# EAGLE design L3D_Main Board_v2 (EAGLE 7.7.0)
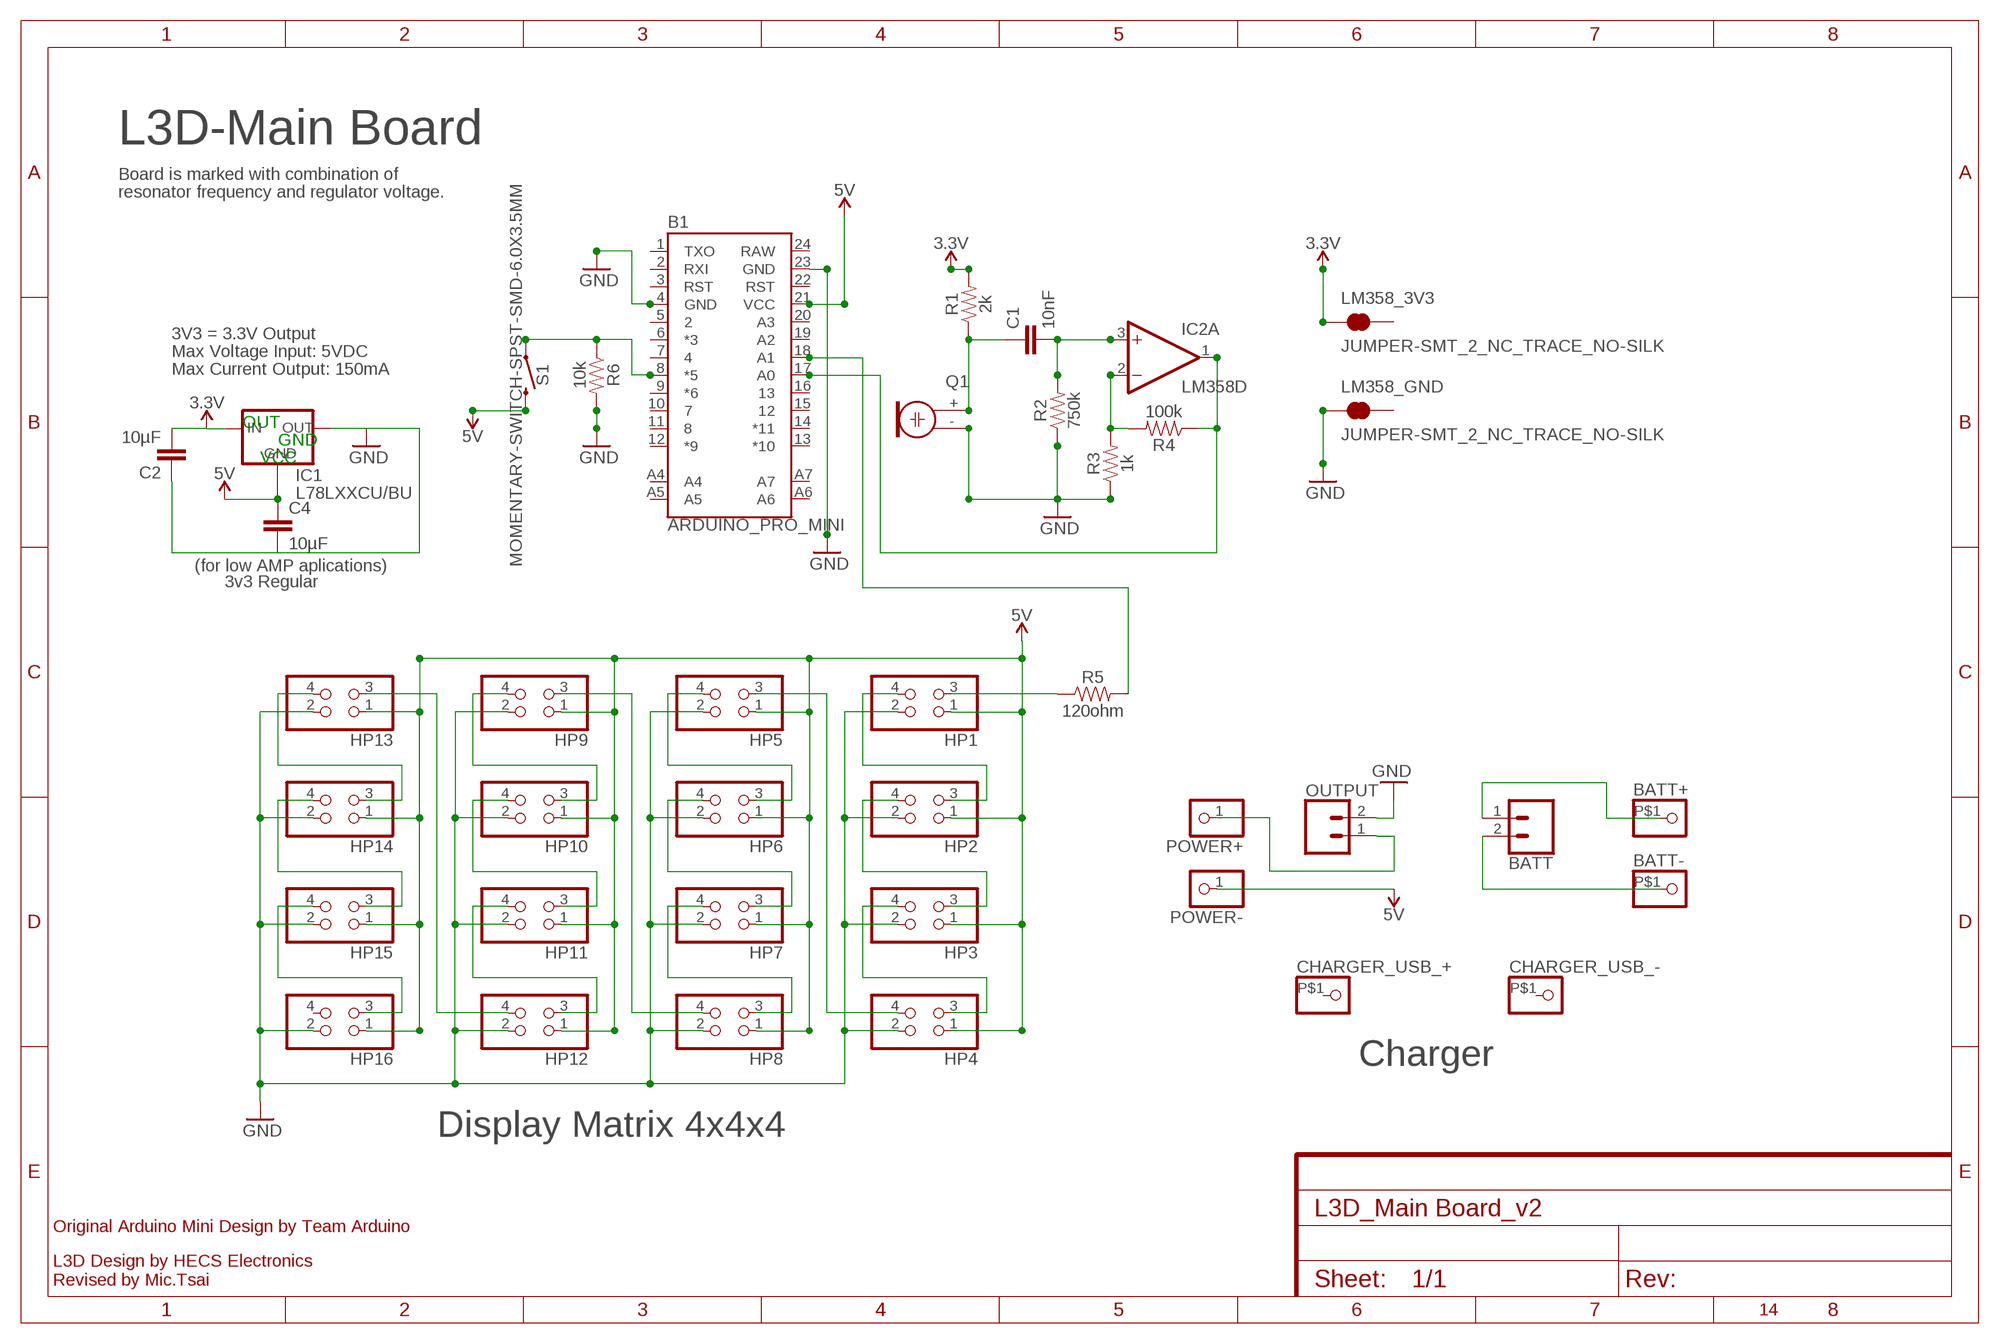
[diagram p0: schematic, sheet 1]

## Parts
B1  ARDUINO_PRO_MINI  [ARDUINO_PRO_MINI]
BATT  CONN_02  [1X02]
BATT+  PINHD-1X1-BIGPOGO  [1X1-BIGPOGO]
BATT-  PINHD-1X1-BIGPOGO  [1X1-BIGPOGO]
C1  10nF  0.33UF/330NF-0805-50V-10%  [0805]
C2  10µF  0.33UF/330NF-0805-50V-10%  [0805]
C4  10µF  0.33UF/330NF-0805-50V-10%  [0805]
CHARGER_USB_+  PINHD-1X1-BIGPOGO  [1X1-BIGPOGO]
CHARGER_USB_-  PINHD-1X1-BIGPOGO  [1X1-BIGPOGO]
HP1  PINHD-2X2_2.00  [2X02M]
HP2  PINHD-2X2_2.00  [2X02M]
HP3  PINHD-2X2_2.00  [2X02M]
HP4  PINHD-2X2_2.00  [2X02M]
HP5  PINHD-2X2_2.00  [2X02M]
HP6  PINHD-2X2_2.00  [2X02M]
HP7  PINHD-2X2_2.00  [2X02M]
HP8  PINHD-2X2_2.00  [2X02M]
HP9  PINHD-2X2_2.00  [2X02M]
HP10  PINHD-2X2_2.00  [2X02M]
HP11  PINHD-2X2_2.00  [2X02M]
HP12  PINHD-2X2_2.00  [2X02M]
HP13  PINHD-2X2_2.00  [2X02M]
HP14  PINHD-2X2_2.00  [2X02M]
HP15  PINHD-2X2_2.00  [2X02M]
HP16  PINHD-2X2_2.00  [2X02M]
IC1  L78LXXCU/BU  [SOT89]
IC2  LM358D  [SO08]
LM358_3V3  JUMPER-SMT_2_NC_TRACE_NO-SILK  [SMT-JUMPER_2_NC_TRACE_NO-SILK]
LM358_GND  JUMPER-SMT_2_NC_TRACE_NO-SILK  [SMT-JUMPER_2_NC_TRACE_NO-SILK]
OUTPUT  CONN_02  [1X02]
POWER+  PINHD-1X1  [1X01]
POWER-  PINHD-1X1  [1X01]
Q1  ELECTRET  [9.7ELECTRET]
R1  2k  820KOHM-0603-1/10W-1%  [0603]
R2  750k  820KOHM-0603-1/10W-1%  [0603]
R3  1k  820KOHM-0603-1/10W-1%  [0603]
R4  100k  820KOHM-0603-1/10W-1%  [0603]
R5  120ohm  0.1OHM-1210-1/2W-1%  [1210]
R6  10k  820KOHM-0603-1/10W-1%  [0603]
S1  MOMENTARY-SWITCH-SPST-SMD-6.0X3.5MM  [TACTILE_SWITCH_SMD_6.0X3.5MM]

## Nets
3.3V: C2.2 IC1.3(IN) LM358_3V3.1 R1.2
5V: B1.21(VCC) C4.1 HP1.1 HP2.1 HP3.1 HP4.1 HP5.1 HP6.1 HP7.1 HP8.1 HP9.1 HP10.1 HP11.1 HP12.1 HP13.1 HP14.1 HP15.1 HP16.1 IC1.4(GND1) POWER-.1 S1.2
GND [vcc]: B1.4(GND) B1.23(GND) C2.1 C4.2 HP1.2 HP2.2 HP3.2 HP4.2 HP5.2 HP6.2 HP7.2 HP8.2 HP9.2 HP10.2 HP11.2 HP12.2 HP13.2 HP14.2 HP15.2 HP16.2 IC1.1(OUT) LM358_GND.1 OUTPUT.2 Q1.- R2.1 R3.1 R6.2
N$1: C1.2 IC2.3(A:+IN) R2.2
N$2: C1.1 Q1.+ R1.1
N$3: IC2.2(A:-IN) R3.2 R4.2
N$4: HP1.4 HP2.3
N$5: HP2.4 HP3.3
N$6: HP3.4 HP4.3
N$7: HP4.4 HP5.3
N$8: HP5.4 HP6.3
N$9: HP6.4 HP7.3
N$10: HP7.4 HP8.3
N$11: HP8.4 HP9.3
N$12: HP9.4 HP10.3
N$13: HP10.4 HP11.3
N$14: HP11.4 HP12.3
N$15: HP12.4 HP13.3
N$16: HP13.4 HP14.3
N$17: HP14.4 HP15.3
N$18: HP15.4 HP16.3
N$19: B1.17(A0) IC2.1(A:OUT) R4.1
N$20: B1.8(*5) R6.1 S1.1
N$21: OUTPUT.1 POWER+.1
N$22: B1.18(A1) R5.2
N$23: HP1.3 R5.1
N$24: BATT+.P$1 BATT.1
N$25: BATT-.P$1 BATT.2
Unconnected: B1.1(TXO) B1.2(RXI) B1.3(RST) B1.5 B1.6(*3) B1.7 B1.9(*6) B1.10 B1.11 B1.12(*9) B1.13(*10) B1.14(*11) B1.15 B1.16 B1.19(A2) B1.20(A3) B1.22(RST) B1.A4 B1.A5 B1.A6 B1.A7 CHARGER_USB_+.P$1 CHARGER_USB_-.P$1 HP16.4 IC1.2(GND) IC2.5(B:+IN) IC2.6(B:-IN) IC2.7(B:OUT) LM358_3V3.2 LM358_GND.2

## Notes on the sheet
- L3D-Main Board
- Board is marked with combination of
- resonator frequency and regulator voltage.
- 3V3 = 3.3V Output
- Max Voltage Input: 5VDC
- Max Current Output: 150mA
- OUT
- GND
- VCC
- (for low AMP aplications)
- 3v3 Regular
- Charger
- Display Matrix 4x4x4
- Original Arduino Mini Design by Team Arduino
- L3D Design by HECS Electronics
  Revised by Mic.Tsai
- 14

## Power pins joined to a net without a drawn wire
RAW: B1.24(RAW)
V+: IC2.8(P:V+)
V-: IC2.4(P:V-)

## Library data of the parts
B1 = SparkFun-Boards:ARDUINO_PRO_MINI: SparkFun Pro Mini Pro Mini compatible footprint. Dimensions: 0.7 x 1.3" PCB Thickness: 0.8mm SparkFun Products: 3.3V/8MHz <https://www.sparkfun.com/products/11114> 5V/16MHz <https://www.sparkfun.com/products/11113>
BATT OUTPUT = SparkFun-Connectors:CONN_02: Multi connection point. Often used as Generic Header-pin footprint for 0.1 inch spaced/style header connections On any of the 0.1 inch spaced packages, you can populate with these: Break Away Headers - Straight <https://www.sparkfun.com/products/116> (PRT-00116) Break Away Male Headers - Right Angle <https://www.sparkfun.com/products/553> (PRT-00553) Female Headers <https://www.sparkfun.com/products/115> (PRT-00115) Break Away Headers - Machine Pin <https://www.sparkfun.com/products/117> (PRT-00117) Break Away Female Headers - Swiss Machine Pin <https://www.sparkfun.com/products/743> (PRT-00743) For SCREWTERMINALS and SPRING TERMINALS visit here: Screw Terimnals on SparkFun.com <https://www.sparkfun.com/search/results?term=Screw+Terminals> (5mm/3.5mm/2.54mm spacing) This device is also useful as a general connection point to wire up your design to another part of your project. Our various solder wires solder well into these plated through hole pads. Hook-Up Wire - Assortment (Stranded, 22 AWG) <https://www.sparkfun.com/products/11375> (PRT-11375) Hook-Up Wire - Assortment (Solid Core, 22 AWG) <https://www.sparkfun.com/products/11367> (PRT-11367) View the entire wire category on our website here <https://www.sparkfun.com/categories/141> Special notes: Molex polarized connector foot print use with: PRT-08233 with associated crimp pins and housings. 2.54_SCREWTERM for use with PRT-10571. 3.5mm Screw Terminal footprints for PRT-08084 5mm Screw Terminal footprints for use with PRT-08432
BATT+ BATT- CHARGER_USB_+ CHARGER_USB_- POWER+ POWER- = adafruit:PINHD-1X1: Pin header 1x1 for 0.1" spacing With round pins
C1 C2 C4 = SparkFun-Capacitors:0.33UF/330NF: 0.33µF/330nF ceramic capacitors A capacitor is a passive two-terminal electrical component used to store electrical energy temporarily in an electric field.; PROD_ID: CAP-08469; VALUE: 0.33µF
HP1-HP16 = pinhead-1:PINHD-2X2: PIN HEADER
IC1 = v-reg-2:L78LXXCU/BU: VOLTAGE REGULATOR
IC2 = linear:LM358: OP AMP also LM158; LM258; LM2904 Source: http://cache.national.com/ds/LM/LM158.pdf
LM358_3V3 LM358_GND = SparkFun-Jumpers:JUMPER-SMT_2_NC_TRACE: Normally closed trace jumper This jumper has a trace between two pads so it's normally closed (NC). Use a razor knife to open the connection. For best results follow the IPC guidelines for cutting traces: Cutout at least 0.063 mm (0.005 in). Remove all loose material to clean up the cut area. Seal the cut with an approved epoxy. Reapply solder to reclose the connection.
Q1 = adafruit:ELECTRET: Electret microphone Thru hole 2.54mm spacing with 9.7mm diameter
R1-R4 R6 = SparkFun-Resistors:820KOHM: 820kΩ resistor A resistor is a passive two-terminal electrical component that implements electrical resistance as a circuit element. Resistors act to reduce current flow, and, at the same time, act to lower voltage levels within circuits. - Wikipedia; PROD_ID: RES-13247; VALUE: 820k
R5 = SparkFun-Resistors:0.1OHM: 0.1Ω resistor A resistor is a passive two-terminal electrical component that implements electrical resistance as a circuit element. Resistors act to reduce current flow, and, at the same time, act to lower voltage levels within circuits. - Wikipedia; PROD_ID: RES-12374; VALUE: 0.1
S1 = SparkFun-Switches:MOMENTARY-SWITCH-SPST: Momentary Switch (Pushbutton) - SPST Normally-open (NO) SPST momentary switches (buttons, pushbuttons). Variants PTH-12MM - 12mm square, through-hole Momentary Pushbutton Switch - 12mm Square <https://www.sparkfun.com/products/9190> (COM-09190) PTH-6.0MM, PTH-6.0MM-KIT - 6.0mm square, through-hole Mini Pushbutton Switch <https://www.sparkfun.com/products/97> (COM-00097) KIT package intended for soldering kit's - only one side of pads' copper is exposed. PTH-RIGHT-ANGLE-KIT - Right-angle, through-hole Right Angle Tactile Button <https://www.sparkfun.com/products/10791> - Used on SparkFun BigTime Watch Kit <https://www.sparkfun.com/products/11734> SMD-12MM - 12mm square, surface-mount Tactile Button - SMD (12mm) <https://www.sparkfun.com/products/12993> (COM-12993) Used on SparkFun PicoBoard <https://www.sparkfun.com/products/11888> SMD-4.5MM - 4.5mm Square Trackball Switch Used on SparkFun Blackberry Trackballer Breakout <https://www.sparkfun.com/products/13169> SMD-4.6MMX2.8MM - 4.60mm x 2.80mm, surface mount Used on SparkFun SAMD21 Mini Breakout <https://www.sparkfun.com/products/13664> SMD-5.2MM, SMD-5.2-REDUNDANT - 5.2mm square, surface-mount Mini Pushbutton Switch - SMD <https://www.sparkfun.com/products/8720> (COM-08720) Used on Arduino Pro Mini <https://www.sparkfun.com/products/11114> REDUNDANT package connects both switch circuits together SMD-6.0X3.5MM - 6.0 x 3.5mm, surface mount Momentary Reset Switch SMD <https://www.sparkfun.com/products/8229> (COM-08229) SMD-6.2MM-TALL - 6.2mm square, surface mount Tactile Button - SMD (6mm) <https://www.sparkfun.com/products/12992> Used on SparkFun Digital Sandbox <https://www.sparkfun.com/products/12651> SMD-RIGHT-ANGLE - Right-angle, surface mount Used on SparkFun Block for Intel® Edison - Arduino <https://www.sparkfun.com/products/13036>; PROD_ID: SWCH-00815; SF_SKU: COM-08229

## Net classes
0 default: width 0.203 mm
1 vcc: width 0.254 mm

## Board
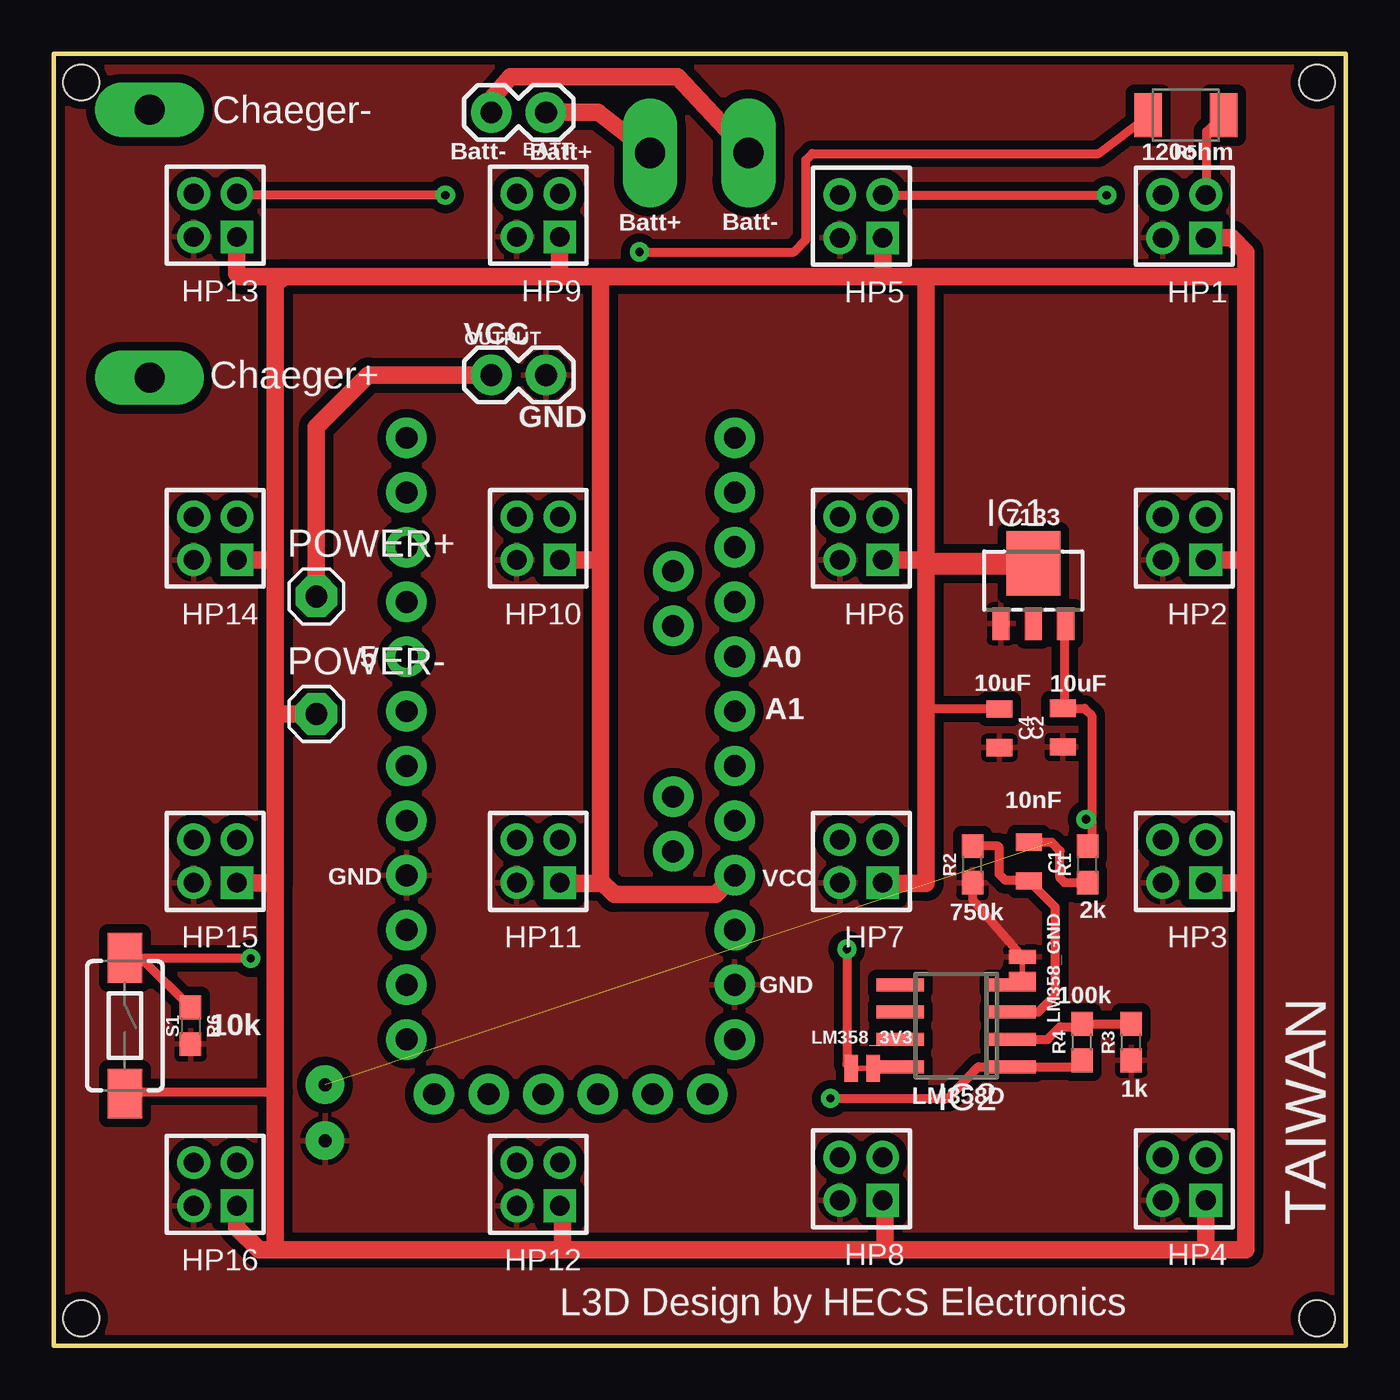
[diagram p1: board, top side]
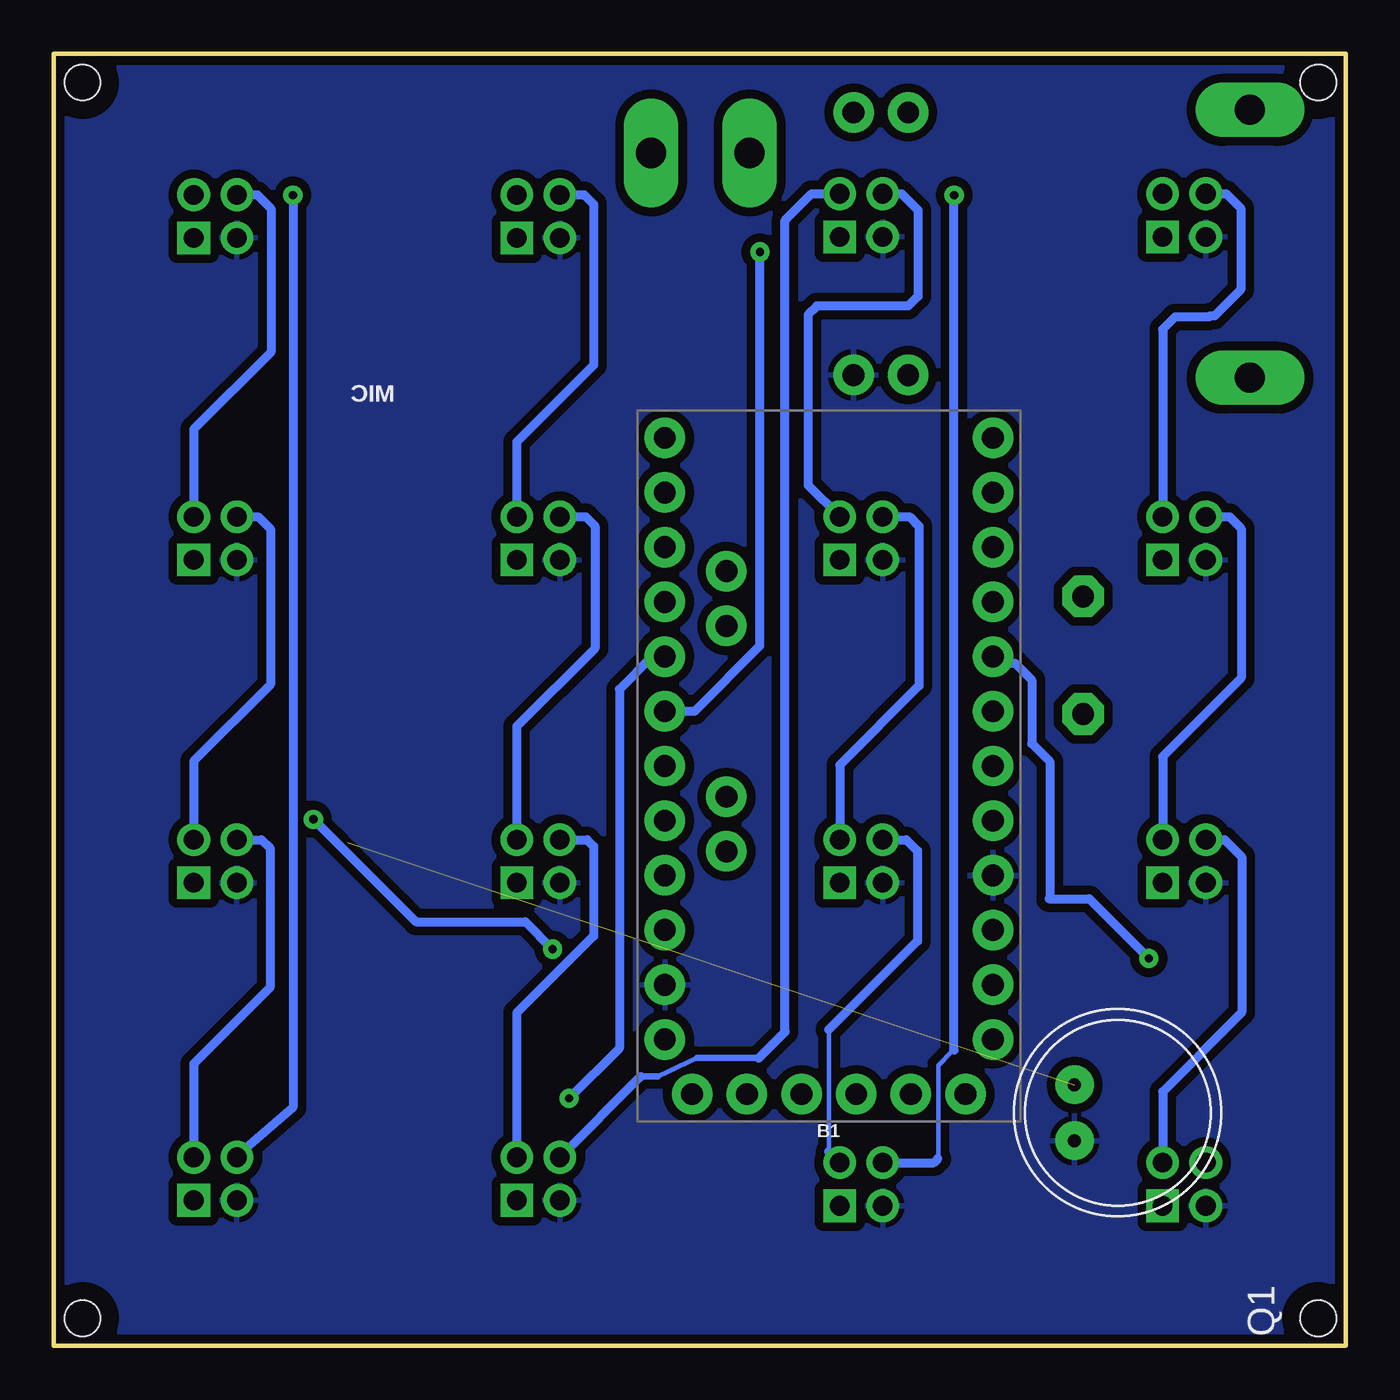
[diagram p2: board, bottom side, seen from below]

Size 60 x 60 mm. Coordinates in mm from the lower left corner, seen from the top.
Outline: 0,60 0,0 60,0 60,60 0,60
Copper layers (1*16): Top 0.035mm / dielectric 1.5mm / Bottom 0.035mm
Design rules "SparkFun-2-layer *": minimum track width 7mil, minimum drill 15mil, track to track 8mil, track to pad 8mil, pad to pad 8mil, via to via 8mil, smd to smd 8mil, copper to edge 8mil, drill to drill 8mil, minimum pad ring 12mil, minimum via ring 10mil, stop-mask expansion 4mil, vias tented up to drill 20mil, thermal gap 10mil
Holes 1.65 mm at 1.27,1.27 58.67,1.27 1.27,58.67 58.67,58.67
bRestrict: area 0.1,0.1 to 2.4,2.4; area 57.5,0.1 to 59.8,2.4; area 0.1,57.5 to 2.4,59.8; area 57.5,57.5 to 59.8,59.8

### Footprints (pad centres in the part's own frame; a part is rotated, then mirrored left to right if it is on the bottom)
ARDUINO_PRO_MINI = drill 1.016 pad 1.88: 1 -7.62,12.7; 2 -7.62,10.16; 3 -7.62,7.62; 4 -7.62,5.08; 5 -7.62,2.54; 6 -7.62,0; 7 -7.62,-2.54; 8 -7.62,-5.08; 9 -7.62,-7.62; 10 -7.62,-10.16; 11 -7.62,-12.7; 12 -7.62,-15.24; 13 7.62,-15.24; 14 7.62,-12.7; 15 7.62,-10.16; 16 7.62,-7.62; 17 7.62,-5.08; 18 7.62,-2.54; 19 7.62,0; 20 7.62,2.54; 21 7.62,5.08; 22 7.62,7.62; 23 7.62,10.16; 24 7.62,12.7; A4 4.763,1.429; A5 4.763,3.969; A6 4.763,-9.049; A7 4.763,-6.509; BLK -6.35,15.24; GND -3.81,15.24; GRN 6.35,15.24; RXI 1.27,15.24; TXO 3.81,15.24; VCC -1.27,15.24
1X02 = drill 1.016 pad 1.88: 1 0,0; 2 2.54,0
1X1-BIGPOGO = drill 1.4 pad 2.54 long: P$1 0,0
0805 = smd 0.8 x 1.2: 1 -0.9,0; 2 0.9,0
2X02M = drill 0.914 square: 1 -1,-1 | drill 0.914: 2 -1,1; 3 1,-1; 4 1,1
SOT89 = smd 0.8 x 1.5: 1 -1.5,-1.75; 2 0,-1.75; 3 1.5,-1.75 | smd 2.5 x 3: 4 0,1.05
SO08 = smd 0.6 x 2.2: 1 -1.905,-2.6; 2 -0.635,-2.6; 3 0.635,-2.6; 4 1.905,-2.6; 5 1.905,2.6; 6 0.635,2.6; 7 -0.635,2.6; 8 -1.905,2.6
SMT-JUMPER_2_NC_TRACE_NO-SILK = smd 0.635 x 1.27: 1 -0.508,0; 2 0.508,0
1X01 = drill 1.016 pad 1.93 octagon: 1 0,0
9.7ELECTRET = drill 0.6 pad 1.778: + 1.3,2; - -1.3,2
0603 = smd 1.1 x 1: 1 -0.85,0; 2 0.85,0
1210 = smd 1.27 x 2.06: 1 -1.755,0; 2 1.755,0
TACTILE_SWITCH_SMD_6.0X3.5MM = smd 2.3 x 1.6: 1 -3.15,0; 2 3.15,0

### Placement (x,y rotation side)
B1  24,26.92 180 bottom
BATT  22.86,57.28 180 top
BATT+  27.69,55.4 270 bottom
BATT-  32.26,55.4 270 bottom
C1  45.29,22.48 270 top
C2  46.86,28.7 90 top
C4  43.92,28.68 270 top
CHARGER_USB_+  4.45,44.96 0 top
CHARGER_USB_-  4.45,57.4 0 top
HP1  52.5,52.45 90 top
HP2  52.5,37.5 90 top
HP3  52.5,22.5 90 top
HP4  52.5,7.75 90 top
HP5  37.5,52.45 90 top
HP6  37.5,37.5 90 top
HP7  37.5,22.5 90 top
HP8  37.5,7.75 90 top
HP9  22.5,52.5 90 top
HP10  22.5,37.5 90 top
HP11  22.5,22.5 90 top
HP12  22.5,7.5 90 top
HP13  7.5,52.5 90 top
HP14  7.5,37.5 90 top
HP15  7.5,22.5 90 top
HP16  7.5,7.5 90 top
IC1  45.49,35.28 0 top
IC2  41.91,14.86 90 top
LM358_3V3  37.54,12.88 0 top
LM358_GND  44.98,17.55 270 top
OUTPUT  20.32,45.09 0 top
POWER+  12.19,34.8 0 top
POWER-  12.19,29.34 0 top
Q1  10.59,10.82 90 bottom
R1  48.01,22.35 90 top
R2  42.67,22.35 90 top
R3  50.04,14.1 90 top
R4  47.75,14.1 90 top
R5  52.58,57.15 180 top
R6  6.35,14.86 270 top
S1  3.3,14.86 270 top

### Tracks (layer width: path | path; a pad name or v marks a point on that pad's centre or on a via)
3.3V  (via drill 0.38)
  Top 0.203: 46.97,29.67 46.94,29.67 C2.2 | 46.97,33.53 IC1.3 | v47.94,24.45 48.21,24.45 48.26,24.45
  Top 0.406: 46.97,29.67 46.97,33.53 | C2.2 47.87,29.6 48.21,29.26 48.21,24.45 48.21,23.41 R1.2 | v36.83,18.41 36.83,13.08 LM358_3V3.1
  Bottom 0.406: v36.83,18.41 38.1,19.68 43.18,19.68 v47.94,24.45
5V
  Top 0.203: 3.35,11.79 S1.2 | 43.89,29.57 C4.1 | 44.3,36.47 44.4,36.37 45.41,36.37 IC1.4
  Top 0.406: 3.35,11.79 10.29,11.79 | 43.89,29.57 40.51,29.57 40.51,29.52
  Top 0.61: 55.4,41.81 55.37,41.78
  Top 0.813: HP16.1 8.5,5.47 9.53,4.45 23.62,4.45 | 23.62,4.45 38.61,4.45 | 38.61,4.45 53.47,4.45 | 53.47,4.45 55.37,4.45 55.37,21.59 | HP4.1 53.5,4.48 53.47,4.45 | HP12.1 23.62,6.38 23.62,4.45 | HP8.1 38.61,6.64 38.61,4.45 | 55.37,49.66 55.37,41.78 55.37,36.32 | 55.37,36.32 55.37,21.59 | HP1.1 54.72,51.45 55.37,50.8 55.37,49.66 | 55.37,49.66 40.51,49.66 | 23.5,49.66 10.67,49.66 | 10.67,49.66 8.64,49.66 8.5,49.79 HP13.1 | 10.67,49.66 10.29,49.28 10.29,36.32 | 10.29,36.32 10.29,29.08 | 10.29,29.08 10.29,21.46 | 10.29,4.57 10.29,11.79 10.29,21.46 | 10.29,21.46 10.25,21.5 HP15.1 | HP14.1 10.11,36.5 10.29,36.32 | POWER-.1 10.54,29.34 10.29,29.08 | HP5.1 38.5,49.77 38.61,49.66 | 38.61,49.66 25.4,49.66 | 25.4,49.66 25.4,36.32 | 25.4,36.32 25.4,21.59 | 25.4,21.59 25.4,21.46 23.54,21.46 HP11.1 | 25.4,49.66 23.5,49.66 | 23.5,49.66 HP9.1 | 38.61,49.66 40.51,49.66 | 40.51,49.66 40.51,36.45 | 40.51,36.45 40.51,29.52 40.51,21.46 38.54,21.46 HP7.1 | HP10.1 25.22,36.5 25.4,36.32 | HP6.1 40.46,36.5 40.51,36.45 | HP2.1 55.19,36.5 55.37,36.32 | HP3.1 55.28,21.5 55.37,21.59 | B1.21 30.73,20.95 26.04,20.95 25.4,21.59
  Top 1.016: 40.51,36.45 40.63,36.33 IC1.4
GND
  Top 0.406: R2.1 42.67,20.73 LM358_GND.1
  pour Top (isolate 0.406): 0.25,59.75 59.75,59.75 59.75,0.25 0.25,0.25
  pour Bottom (isolate 0.406): 0.25,59.75 59.75,59.75 59.75,0.25 0.25,0.25
N$1
  Top 0.406: R2.2 43.85,23.2 43.92,23.14 43.92,21.89 44.2,21.61 45.25,21.61 C1.2 46.51,20.36 46.51,16.28 45.72,15.49 IC2.3
N$2  (1 unrouted)
  Top 0.406: R1.1 46.95,21.5 46.74,21.72 46.74,22.99 46.34,23.38 C1.1
N$3
  Top 0.406: IC2.2 46.15,14.22 46.74,14.81 47.61,14.81 R4.2 R3.2
N$4
  Bottom 0.406: HP1.4 50.55,53.45 49.91,52.81 49.91,46.15 53.5,42.56 HP2.3
N$5
  Bottom 0.406: HP2.4 50.51,38.5 49.94,37.92 49.94,30.71 53.5,27.14 HP3.3
N$6
  Bottom 0.406: HP3.4 50.35,23.5 49.96,23.11 49.96,16.64 53.5,13.1 HP4.3
N$7  (via drill 0.38)
  Top 0.203: HP5.3
  Top 0.406: HP5.3 v48.9,53.44
  Bottom 0.406: v48.9,53.44 48.9,11.07 51.08,9.17 51.41,8.84 HP4.4
N$8
  Bottom 0.406: HP5.4 35.37,53.45 34.92,53.01 34.92,45.54 38.5,41.97 HP6.3
N$9
  Bottom 0.406: HP6.4 35.3,38.5 34.87,38.08 34.87,32.38 38.5,28.76 HP7.3
N$10
  Bottom 0.406: HP7.4 35.23,23.5 34.92,23.19 34.92,19.02 38.5,15.45 HP8.3
N$11
  Bottom 0.203: 31.93,12.5 30.12,13.36
  Bottom 0.305: 32.75,12.5 31.93,12.5 | 30.12,13.36 27.25,13.36
  Bottom 0.406: HP8.4 32.75,12.5 | 27.25,13.36 26.04,14.58 26.04,52.27 24.81,53.5 HP9.3
N$12
  Bottom 0.406: HP9.4 20.63,53.5 19.86,52.73 19.86,48.74 20.32,48.28 24.56,48.28 24.97,47.88 24.97,39.97 HP10.3
N$13
  Bottom 0.406: HP10.4 20.26,38.5 19.81,38.05 19.81,30.66 23.5,26.97 HP11.3
N$14
  Bottom 0.203: 24,14.68 24,9
  Bottom 0.406: HP11.4 20.4,23.5 19.89,22.99 19.89,18.8 24,14.68 | 24,9 HP12.3
N$15  (via drill 0.38)
  Top 0.203: 8.53,53.44 HP13.3
  Top 0.406: v18.19,53.44 8.53,53.44
  Bottom 0.203: 18.95,8.69 18.92,8.71 18.92,13.03 18.29,13.66 18.19,13.72
  Bottom 0.406: HP12.4 19.14,8.5 18.95,8.69 | 18.19,13.72 v18.19,53.44
N$16
  Bottom 0.406: HP13.4 5.54,53.5 4.88,52.83 4.88,49.05 6.1,47.83 6.3,47.83 6.35,47.78 7.92,47.78 8.5,47.2 HP14.3
N$17
  Bottom 0.406: HP14.4 5.4,38.5 4.85,37.95 4.85,31.01 8.5,27.36 HP15.3
N$18
  Bottom 0.406: HP15.4 5.62,23.5 4.83,22.71 4.83,15.47 8.5,11.79 HP16.3
N$19  (via drill 0.38)
  Top 0.203: 44.6,12.95 IC2.1
  Top 0.406: IC2.1 42.95,12.95 41.55,11.48 v36.07,11.48 | 44.6,12.95 47.31,12.95 R4.1
  Bottom 0.406: v36.07,11.48 33.73,13.82 33.73,30.48 32.21,32 B1.17
N$20  (via drill 0.38)
  Top 0.203: 6.3,15.75 R6.1 | S1.1 3.35,17.98 4.06,17.98 4.12,17.93 4.17,17.98
  Top 0.406: 4.12,17.93 6.3,15.75 | v9.14,17.98 4.17,17.98
  Bottom 0.203: B1.8 16.51,31.75 16.36,31.7
  Bottom 0.406: 16.36,31.7 15.37,31.7 14.58,30.91 14.58,27.96 13.74,27.13 13.74,20.78 13.77,20.75 11.91,20.75 v9.14,17.98
N$21
  Top 0.813: POWER+.1 12.19,42.67 14.61,45.09 OUTPUT.1
N$22  (via drill 0.38)
  Top 0.203: 50.8,57.1 R5.2
  Top 0.406: 50.8,57.1 48.51,55.37 35.23,55.37 34.92,55.07 34.92,51.36 34.37,50.8 v27.2,50.8
  Bottom 0.406: v27.2,50.8 27.2,32.51 30.25,29.46 B1.18
N$23
  Top 0.203: 54.25,57.1 R5.1 | 53.54,53.54 HP1.3
  Top 0.406: 54.25,57.1 53.54,56.39 53.54,53.54
N$24
  Top 0.813: BATT.1 25.27,57.28 BATT+.P$1
N$25
  Top 0.813: BATT.2 20.32,57.91 21.21,58.93 28.96,58.93 BATT-.P$1

### Text on the board
tPlace: Chaeger- | Batt- | Batt+ | 120ohm | Batt+ | Batt- | VCC | Chaeger+ | GND | 7133 | 5 | A0 | 10uF | 10uF | A1 | 10nF | GND | VCC | 750k | 2k | GND | 100k | 10k | 1k | LM358D | TAIWAN | L3D Design by HECS Electronics
bPlace: MIC
tValues: Valid combinations: | 168V / 3.3V Reg / 8MHz | 168 / 5V Reg / 16MHz | 168 / 5V Reg / 20MHz | Mark back accordingly
tDocu: Original Arduino Mini Design by Team Arduino / L3D Design by HECS Electronics / Revised by Mic.Tsai